# EAGLE design Son_Of_Dark_Power_Rev3 (EAGLE 7.2.0)

## Sheet 1 of 8
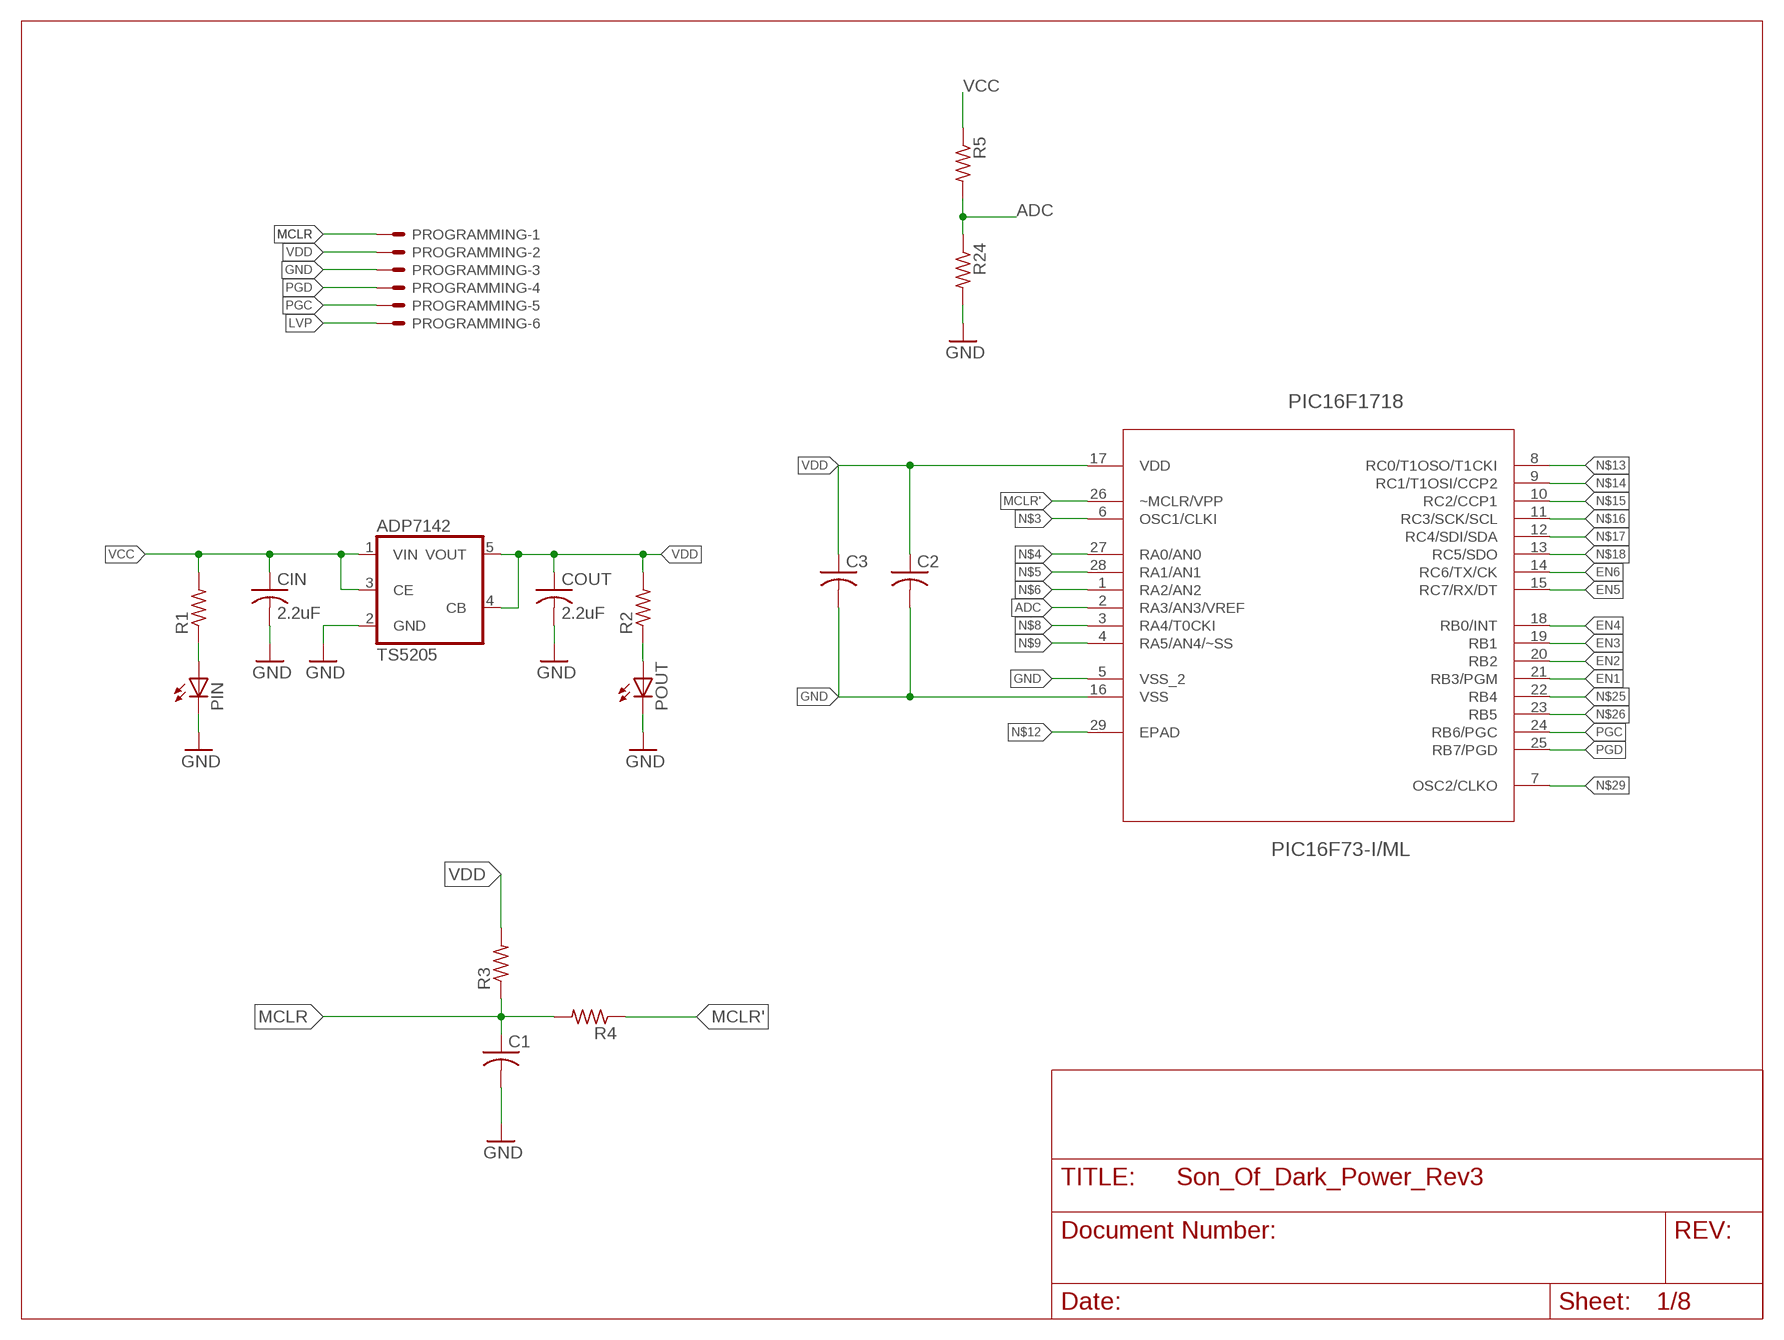
[diagram p0: schematic, sheet 1]

### Parts
ADP7142  TS5205  [SOT25]
C1  C-USC0805  [C0805]
C2  C-USC0805  [C0805]
C3  C-USC0805  [C0805]
CIN  2.2uF  C-USC1206K  [C1206K]
COUT  2.2uF  C-USC1206K  [C1206K]
PIC16F1718  PIC16F73-I/ML  [QFN65P600X600X100-28N]
PIN  LEDCHIPLED_1206  [CHIPLED_1206]
POUT  LEDCHIPLED_1206  [CHIPLED_1206]
PROGRAMMING  22-23-2061  [22-23-2061]
R1  R-US_R0805  [R0805]
R2  R-US_R0805  [R0805]
R3  R-US_R0805  [R0805]
R4  R-US_R0805  [R0805]
R5  R-US_R0805  [R0805]
R24  R-US_R0805  [R0805]

### Nets
ADC: PIC16F1718.2(RA3/AN3/VREF) R5.2 R24.1
EN1: PIC16F1718.21(RB3/PGM) ; also sheet 3
EN2: PIC16F1718.20(RB2) ; also sheet 4
EN3: PIC16F1718.19(RB1) ; also sheet 2
EN4: PIC16F1718.18(RB0/INT) ; also sheet 6
EN5: PIC16F1718.15(RC7/RX/DT) ; also sheet 7
EN6: PIC16F1718.14(RC6/TX/CK) ; also sheet 5
GND: ADP7142.2(GND) C1.2 C2.2 C3.2 CIN.2 COUT.2 PIC16F1718.5(VSS_2) PIC16F1718.16(VSS) PIN.C POUT.C PROGRAMMING.3 R24.2 ; also sheet 2,3,4,5,6,7,8
LVP: PROGRAMMING.6
MCLR: C1.1 PROGRAMMING.1 R3.1 R4.2
MCLR': PIC16F1718.26(~MCLR/VPP) R4.1
N$3: PIC16F1718.6(OSC1/CLKI)
N$4: PIC16F1718.27(RA0/AN0)
N$5: PIC16F1718.28(RA1/AN1)
N$6: PIC16F1718.1(RA2/AN2)
N$8: PIC16F1718.3(RA4/T0CKI)
N$9: PIC16F1718.4(RA5/AN4/~SS)
N$10: PIN.A R1.1
N$11: POUT.A R2.1
N$12: PIC16F1718.29(EPAD)
N$13: PIC16F1718.8(RC0/T1OSO/T1CKI)
N$14: PIC16F1718.9(RC1/T1OSI/CCP2)
N$15: PIC16F1718.10(RC2/CCP1)
N$16: PIC16F1718.11(RC3/SCK/SCL)
N$17: PIC16F1718.12(RC4/SDI/SDA)
N$18: PIC16F1718.13(RC5/SDO)
N$25: PIC16F1718.22(RB4)
N$26: PIC16F1718.23(RB5)
N$29: PIC16F1718.7(OSC2/CLKO)
PGC: PIC16F1718.24(RB6/PGC) PROGRAMMING.5
PGD: PIC16F1718.25(RB7/PGD) PROGRAMMING.4
VCC: ADP7142.1(VIN) ADP7142.3(CE) CIN.1 R1.2 R5.1 ; also sheet 2,3,4,5,6,7,8
VDD: ADP7142.4(CB) ADP7142.5(VOUT) C2.1 C3.1 COUT.1 PIC16F1718.17(VDD) PROGRAMMING.2 R2.2 R3.2

## Sheet 2 of 8
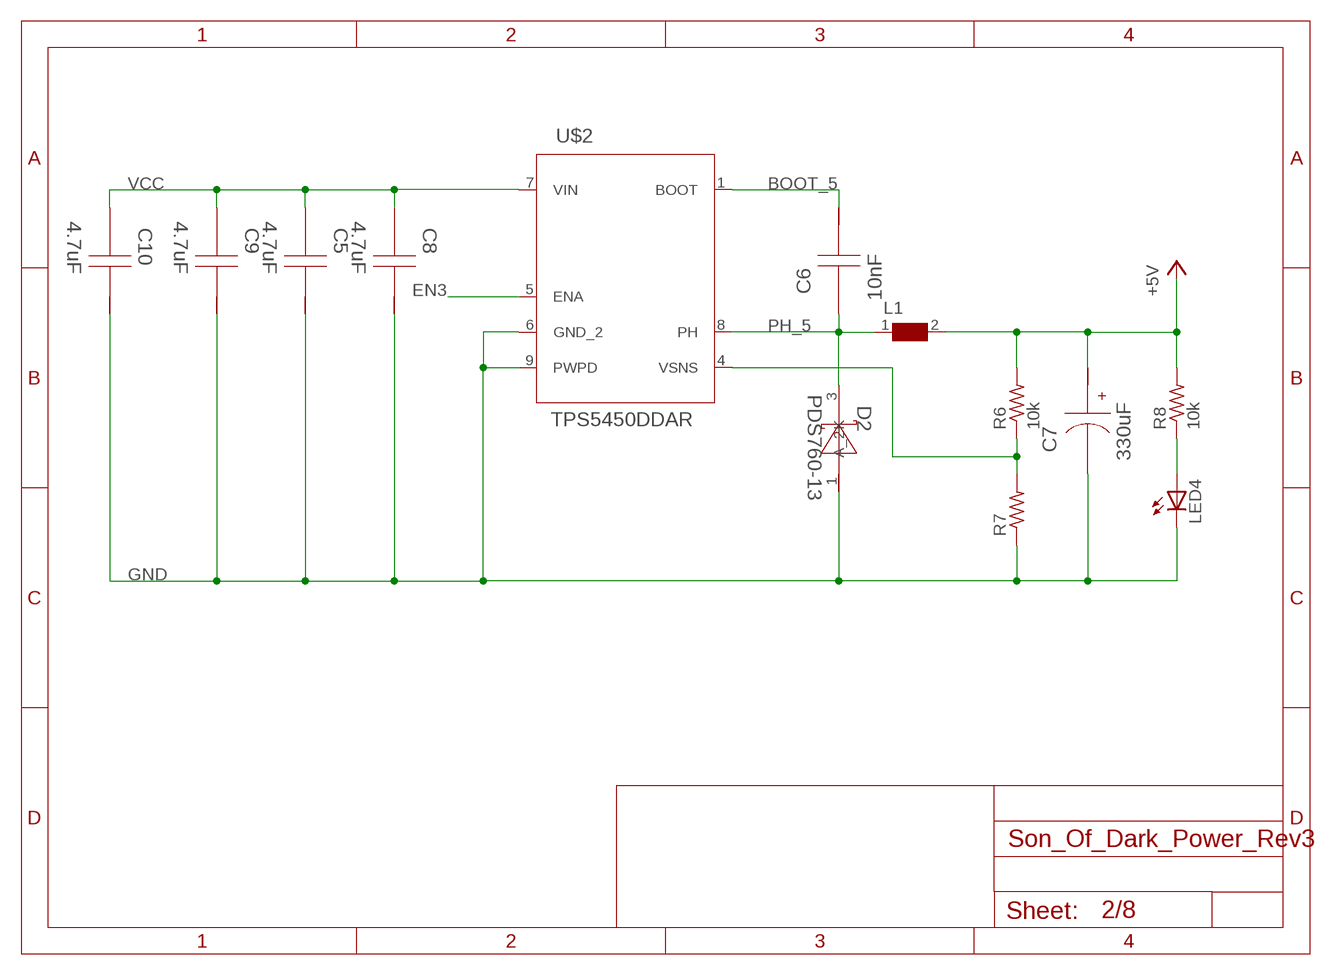
[diagram p1: schematic, sheet 2]

### Parts
C5  4.7uF  GRM31CR71H475KA12L  [1206]
C6  10nF  C0805C103K5RACTU  [0805]
C7  330uF  10SVP330MX  [SM_RADIAL_10AMM]
C8  4.7uF  GRM31CR71H475KA12L  [1206]
C9  4.7uF  GRM31CR71H475KA12L  [1206]
C10  4.7uF  GRM31CR71H475KA12L  [1206]
D2  PDS760-13  [POWERDI5]
L1  WE-HCC-7443331000_1090  [WE-HCC_1090]
LED4  LEDSML1206  [SML1206]
R6  10k  R-US_R1206  [R1206]
R7  R-US_R1206  [R1206]
R8  10k  R-US_R0805  [R0805]
U$2  TPS5450DDAR  [R-PDSO-G8]

### Nets
BOOT_5: C6.1 U$2.1(BOOT)
EN3: U$2.5(ENA) ; also sheet 1
GND: C5.1 C7.2(-) C8.1 C9.1 C10.1 D2.1(A_2) LED4.C R7.1 U$2.6(GND_2) U$2.9(PWPD) ; also sheet 1,3,4,5,6,7,8
N$28: LED4.A R8.1
PH_5: C6.2 D2.3(K) L1.1 U$2.8(PH)
VCC: C5.2 C8.2 C9.2 C10.2 U$2.7(VIN) ; also sheet 1,3,4,5,6,7,8
VOUT_3: C7.1(+) L1.2 R6.2 R8.2 ; supply symbol labelled +5V ; also sheet 8
VSNS_5: R6.1 R7.2 U$2.4(VSNS)

## Sheet 3 of 8
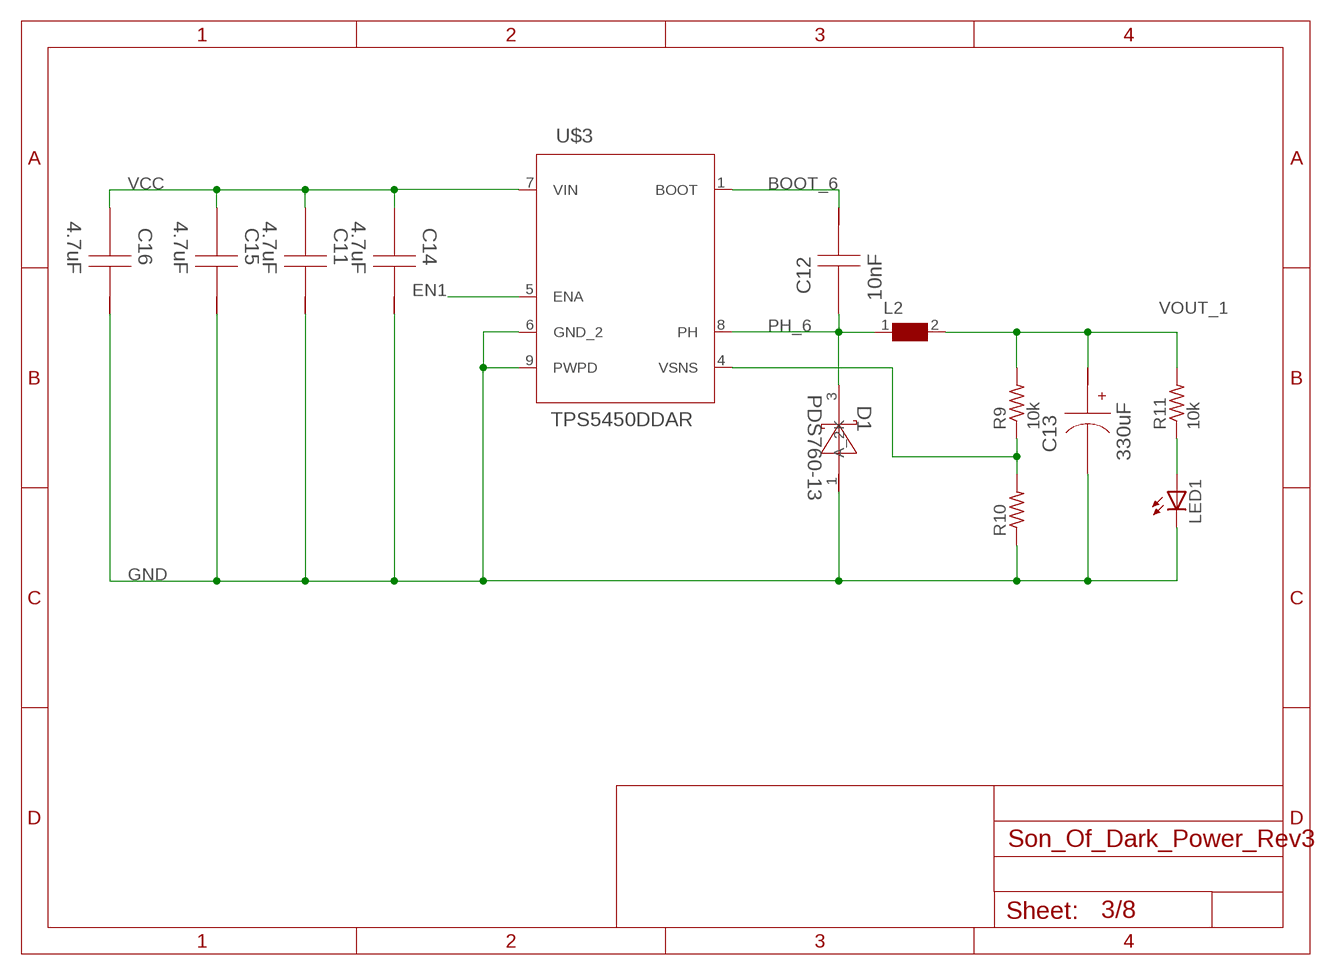
[diagram p2: schematic, sheet 3]

### Parts
C11  4.7uF  GRM31CR71H475KA12L  [1206]
C12  10nF  C0805C103K5RACTU  [0805]
C13  330uF  10SVP330MX  [SM_RADIAL_10AMM]
C14  4.7uF  GRM31CR71H475KA12L  [1206]
C15  4.7uF  GRM31CR71H475KA12L  [1206]
C16  4.7uF  GRM31CR71H475KA12L  [1206]
D1  PDS760-13  [POWERDI5]
L2  WE-HCC-7443331000_1090  [WE-HCC_1090]
LED1  LEDSML1206  [SML1206]
R9  10k  R-US_R1206  [R1206]
R10  R-US_R1206  [R1206]
R11  10k  R-US_R0805  [R0805]
U$3  TPS5450DDAR  [R-PDSO-G8]

### Nets
BOOT_6: C12.1 U$3.1(BOOT)
EN1: U$3.5(ENA) ; also sheet 1
GND: C11.1 C13.2(-) C14.1 C15.1 C16.1 D1.1(A_2) LED1.C R10.1 U$3.6(GND_2) U$3.9(PWPD) ; also sheet 1,2,4,5,6,7,8
N$30: LED1.A R11.1
PH_6: C12.2 D1.3(K) L2.1 U$3.8(PH)
VCC: C11.2 C14.2 C15.2 C16.2 U$3.7(VIN) ; also sheet 1,2,4,5,6,7,8
VOUT_1: C13.1(+) L2.2 R9.2 R11.2 ; also sheet 8
VSNS_6: R9.1 R10.2 U$3.4(VSNS)

## Sheet 4 of 8
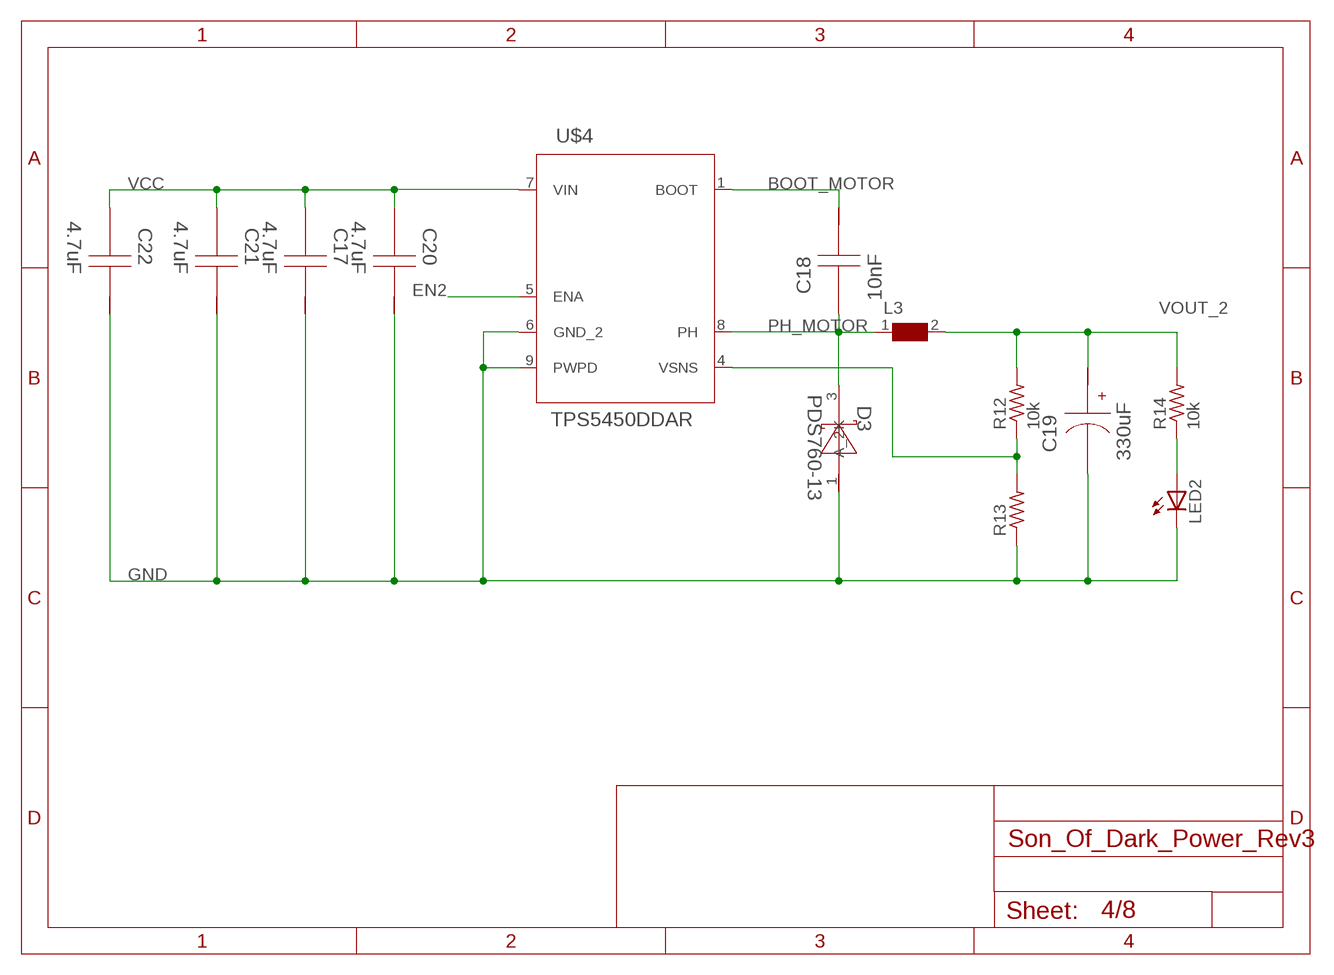
[diagram p3: schematic, sheet 4]

### Parts
C17  4.7uF  GRM31CR71H475KA12L  [1206]
C18  10nF  C0805C103K5RACTU  [0805]
C19  330uF  10SVP330MX  [SM_RADIAL_10AMM]
C20  4.7uF  GRM31CR71H475KA12L  [1206]
C21  4.7uF  GRM31CR71H475KA12L  [1206]
C22  4.7uF  GRM31CR71H475KA12L  [1206]
D3  PDS760-13  [POWERDI5]
L3  WE-HCC-7443331000_1090  [WE-HCC_1090]
LED2  LEDSML1206  [SML1206]
R12  10k  R-US_R1206  [R1206]
R13  R-US_R1206  [R1206]
R14  10k  R-US_R0805  [R0805]
U$4  TPS5450DDAR  [R-PDSO-G8]

### Nets
BOOT_MOTOR: C18.1 U$4.1(BOOT)
EN2: U$4.5(ENA) ; also sheet 1
GND: C17.1 C19.2(-) C20.1 C21.1 C22.1 D3.1(A_2) LED2.C R13.1 U$4.6(GND_2) U$4.9(PWPD) ; also sheet 1,2,3,5,6,7,8
N$31: LED2.A R14.1
PH_MOTOR: C18.2 D3.3(K) L3.1 U$4.8(PH)
VCC: C17.2 C20.2 C21.2 C22.2 U$4.7(VIN) ; also sheet 1,2,3,5,6,7,8
VOUT_2: C19.1(+) L3.2 R12.2 R14.2 ; also sheet 8
VSNS1_MOTOR: R12.1 R13.2 U$4.4(VSNS)

## Sheet 5 of 8
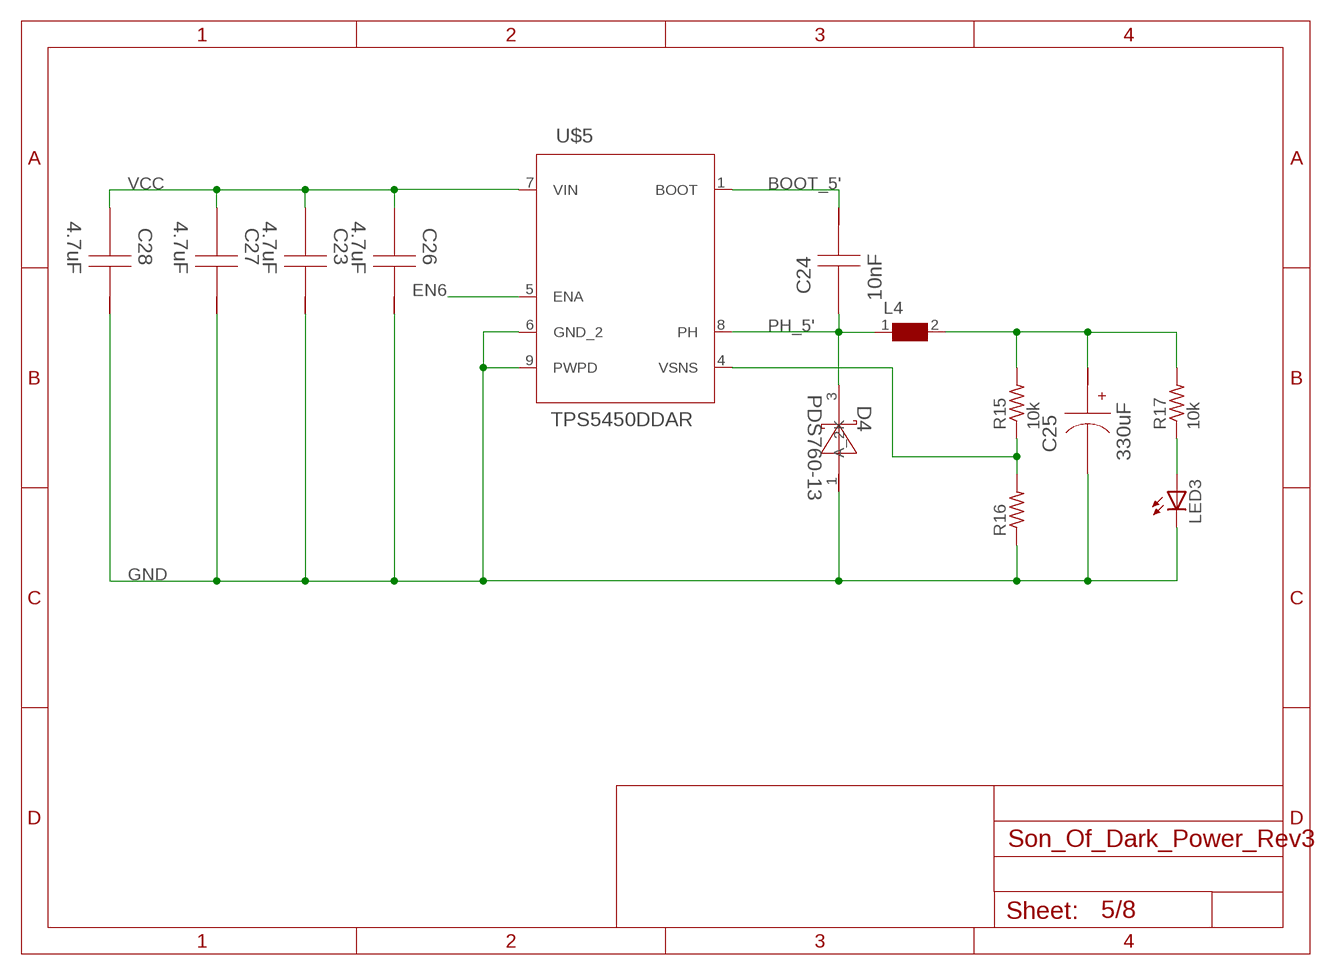
[diagram p4: schematic, sheet 5]

### Parts
C23  4.7uF  GRM31CR71H475KA12L  [1206]
C24  10nF  C0805C103K5RACTU  [0805]
C25  330uF  10SVP330MX  [SM_RADIAL_10AMM]
C26  4.7uF  GRM31CR71H475KA12L  [1206]
C27  4.7uF  GRM31CR71H475KA12L  [1206]
C28  4.7uF  GRM31CR71H475KA12L  [1206]
D4  PDS760-13  [POWERDI5]
L4  WE-HCC-7443331000_1090  [WE-HCC_1090]
LED3  LEDSML1206  [SML1206]
R15  10k  R-US_R1206  [R1206]
R16  R-US_R1206  [R1206]
R17  10k  R-US_R0805  [R0805]
U$5  TPS5450DDAR  [R-PDSO-G8]

### Nets
BOOT_5': C24.1 U$5.1(BOOT)
EN6: U$5.5(ENA) ; also sheet 1
GND: C23.1 C25.2(-) C26.1 C27.1 C28.1 D4.1(A_2) LED3.C R16.1 U$5.6(GND_2) U$5.9(PWPD) ; also sheet 1,2,3,4,6,7,8
N$32': LED3.A R17.1
PH_5': C24.2 D4.3(K) L4.1 U$5.8(PH)
VCC: C23.2 C26.2 C27.2 C28.2 U$5.7(VIN) ; also sheet 1,2,3,4,6,7,8
VOUT_6: C25.1(+) L4.2 R15.2 R17.2 ; also sheet 8
VSNS_1': R15.1 R16.2 U$5.4(VSNS)

## Sheet 6 of 8
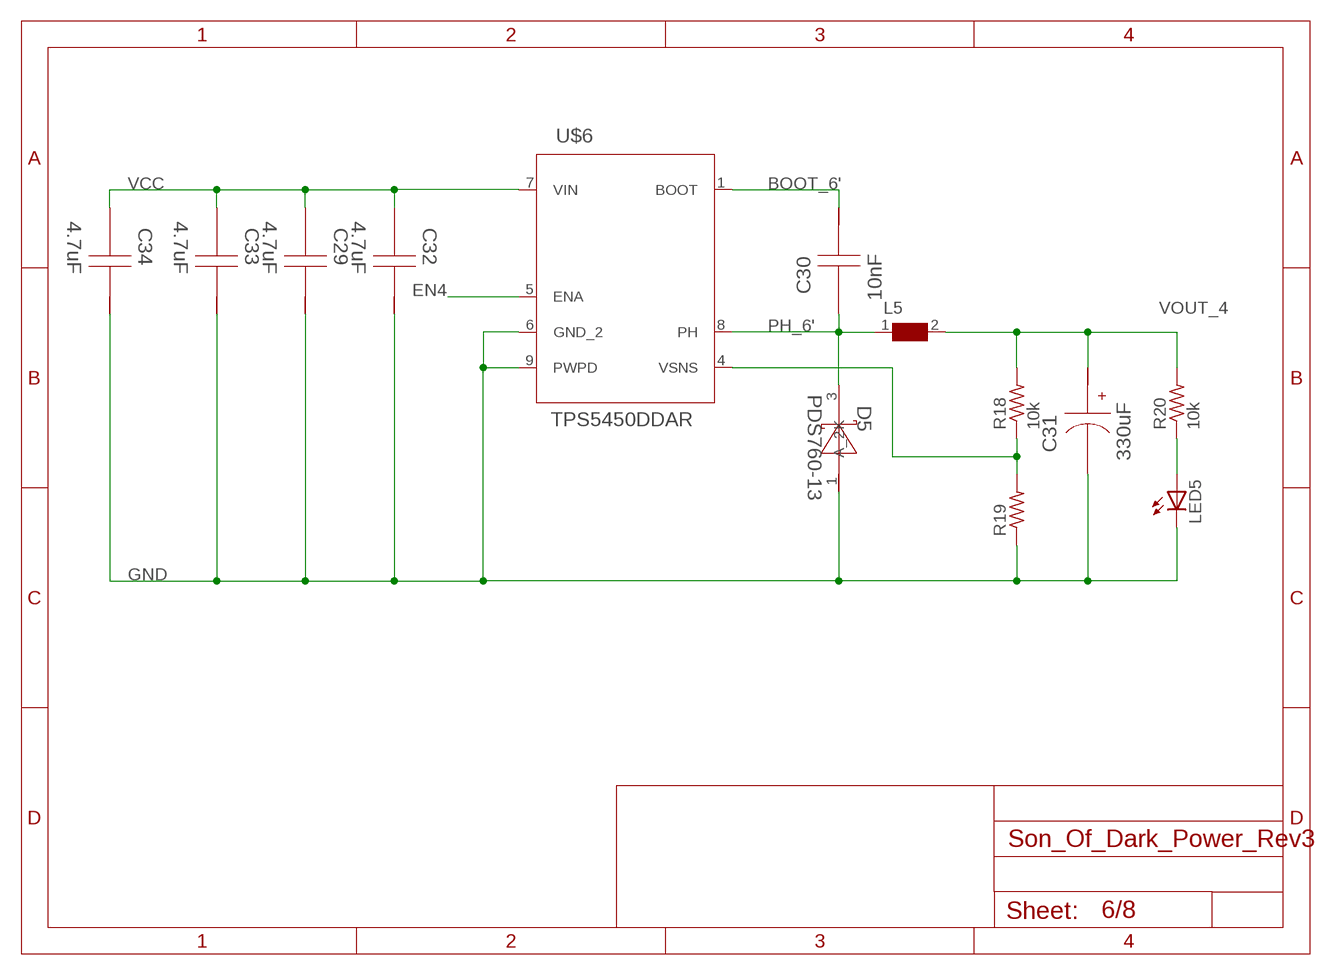
[diagram p5: schematic, sheet 6]

### Parts
C29  4.7uF  GRM31CR71H475KA12L  [1206]
C30  10nF  C0805C103K5RACTU  [0805]
C31  330uF  10SVP330MX  [SM_RADIAL_10AMM]
C32  4.7uF  GRM31CR71H475KA12L  [1206]
C33  4.7uF  GRM31CR71H475KA12L  [1206]
C34  4.7uF  GRM31CR71H475KA12L  [1206]
D5  PDS760-13  [POWERDI5]
L5  WE-HCC-7443331000_1090  [WE-HCC_1090]
LED5  LEDSML1206  [SML1206]
R18  10k  R-US_R1206  [R1206]
R19  R-US_R1206  [R1206]
R20  10k  R-US_R0805  [R0805]
U$6  TPS5450DDAR  [R-PDSO-G8]

### Nets
BOOT_6': C30.1 U$6.1(BOOT)
EN4: U$6.5(ENA) ; also sheet 1
GND: C29.1 C31.2(-) C32.1 C33.1 C34.1 D5.1(A_2) LED5.C R19.1 U$6.6(GND_2) U$6.9(PWPD) ; also sheet 1,2,3,4,5,7,8
N$33': LED5.A R20.1
PH_6': C30.2 D5.3(K) L5.1 U$6.8(PH)
VCC: C29.2 C32.2 C33.2 C34.2 U$6.7(VIN) ; also sheet 1,2,3,4,5,7,8
VOUT_4: C31.1(+) L5.2 R18.2 R20.2 ; also sheet 8
VSNS_2': R18.1 R19.2 U$6.4(VSNS)

## Sheet 7 of 8
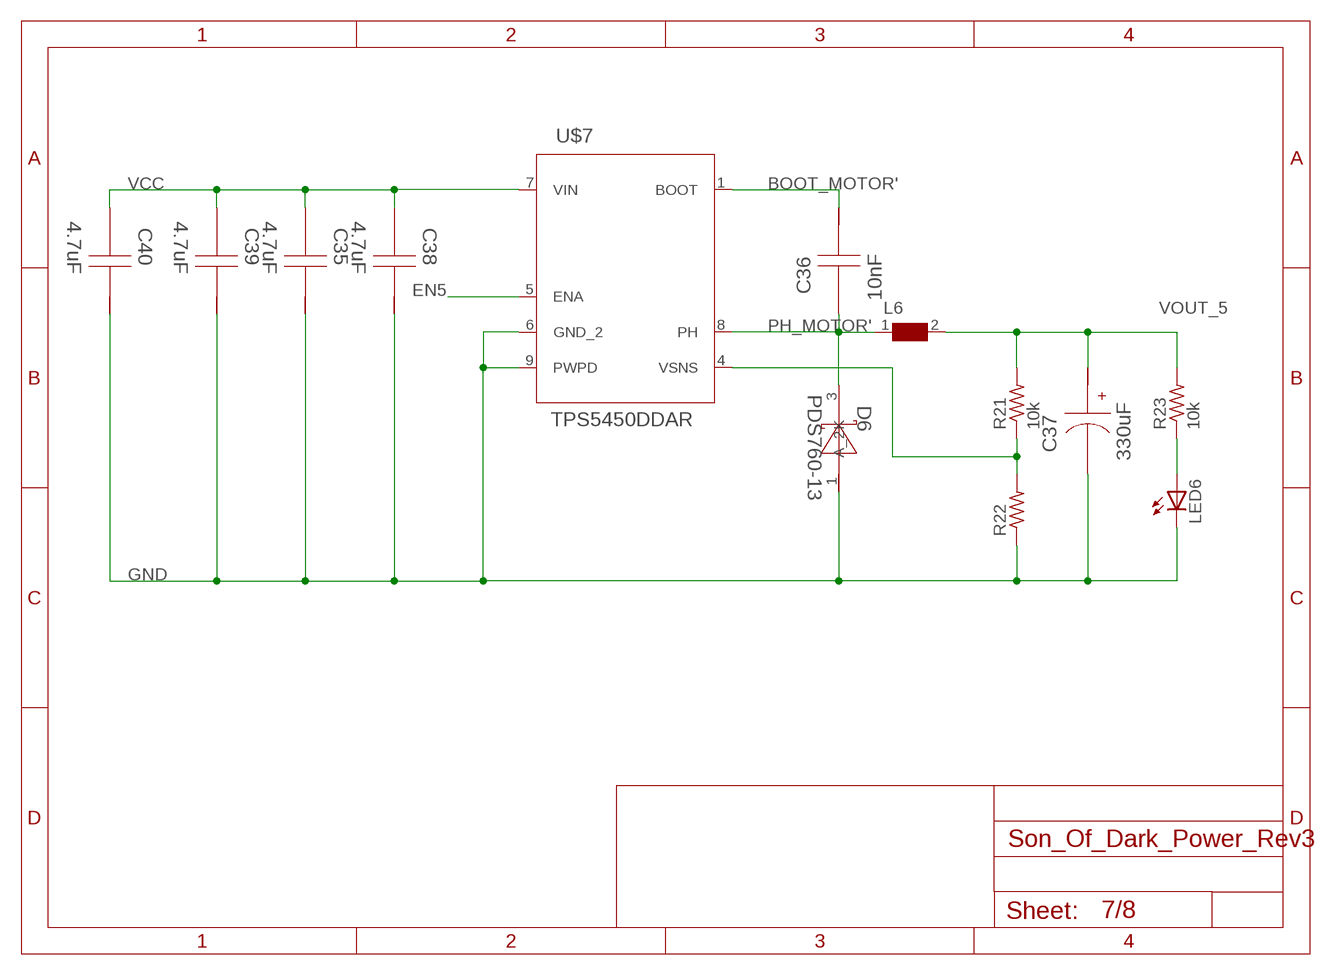
[diagram p6: schematic, sheet 7]

### Parts
C35  4.7uF  GRM31CR71H475KA12L  [1206]
C36  10nF  C0805C103K5RACTU  [0805]
C37  330uF  10SVP330MX  [SM_RADIAL_10AMM]
C38  4.7uF  GRM31CR71H475KA12L  [1206]
C39  4.7uF  GRM31CR71H475KA12L  [1206]
C40  4.7uF  GRM31CR71H475KA12L  [1206]
D6  PDS760-13  [POWERDI5]
L6  WE-HCC-7443331000_1090  [WE-HCC_1090]
LED6  LEDSML1206  [SML1206]
R21  10k  R-US_R1206  [R1206]
R22  R-US_R1206  [R1206]
R23  10k  R-US_R0805  [R0805]
U$7  TPS5450DDAR  [R-PDSO-G8]

### Nets
BOOT_MOTOR': C36.1 U$7.1(BOOT)
EN5: U$7.5(ENA) ; also sheet 1
GND: C35.1 C37.2(-) C38.1 C39.1 C40.1 D6.1(A_2) LED6.C R22.1 U$7.6(GND_2) U$7.9(PWPD) ; also sheet 1,2,3,4,5,6,8
N$34': LED6.A R23.1
PH_MOTOR': C36.2 D6.3(K) L6.1 U$7.8(PH)
VCC: C35.2 C38.2 C39.2 C40.2 U$7.7(VIN) ; also sheet 1,2,3,4,5,6,8
VOUT_5: C37.1(+) L6.2 R21.2 R23.2 ; also sheet 8
VSNS1_MOTOR1': R21.1 R22.2 U$7.4(VSNS)

## Sheet 8 of 8
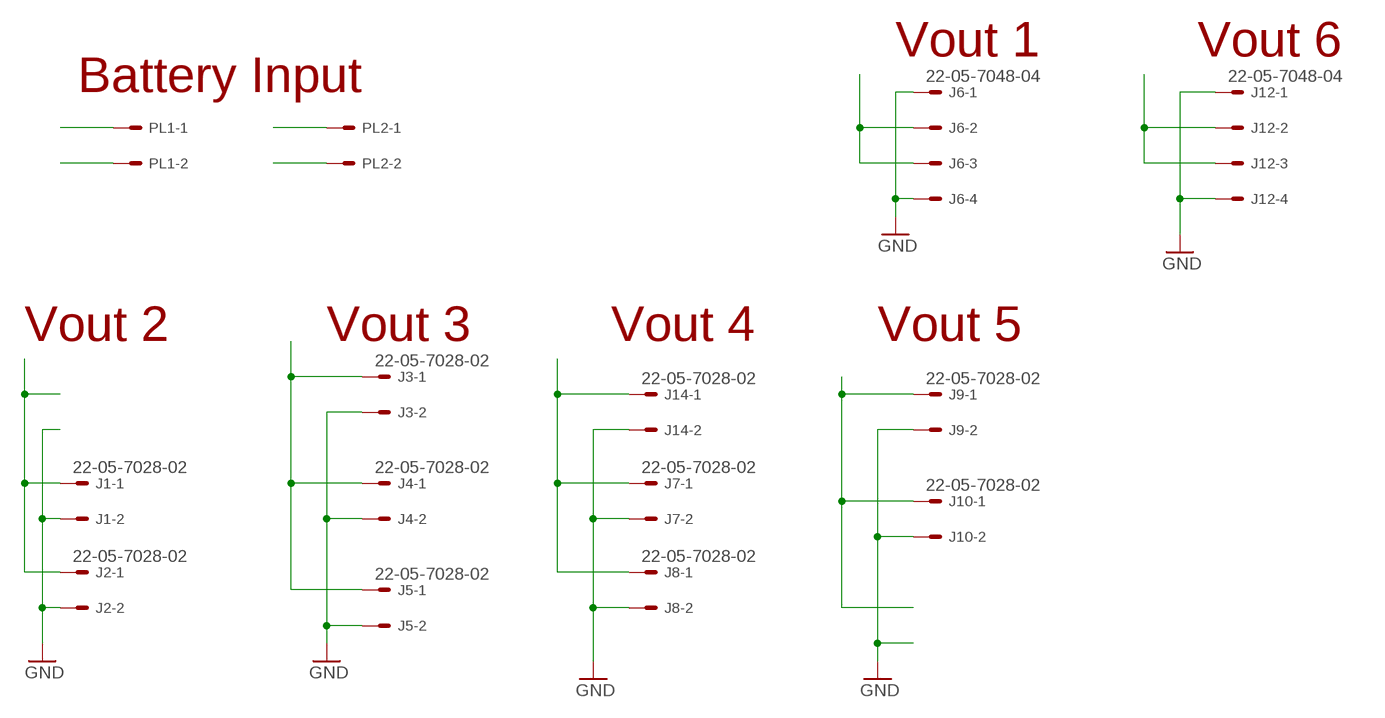
[diagram p7: schematic, sheet 8]

### Parts
J1  22-05-7028-02  [7395-02]
J2  22-05-7028-02  [7395-02]
J3  22-05-7028-02  [7395-02]
J4  22-05-7028-02  [7395-02]
J5  22-05-7028-02  [7395-02]
J6  22-05-7048-04  [7395-04]
J7  22-05-7028-02  [7395-02]
J8  22-05-7028-02  [7395-02]
J9  22-05-7028-02  [7395-02]
J10  22-05-7028-02  [7395-02]
J12  22-05-7048-04  [7395-04]
J14  22-05-7028-02  [7395-02]
PL1  555X-2H  [5569-2]
PL2  555X-2H  [5569-2]

### Nets
GND: J1.2 J2.2 J3.2 J4.2 J5.2 J6.1 J6.4 J7.2 J8.2 J9.2 J10.2 J12.1 J12.4 J14.2 PL1.1 PL2.1 ; also sheet 1,2,3,4,5,6,7
VCC: PL1.2 PL2.2 ; also sheet 1,2,3,4,5,6,7
VOUT_1: J6.2 J6.3 ; also sheet 3
VOUT_2: J1.1 J2.1 ; also sheet 4
VOUT_3: J3.1 J4.1 J5.1 ; also sheet 2
VOUT_4: J7.1 J8.1 J14.1 ; also sheet 6
VOUT_5: J9.1 J10.1 ; also sheet 7
VOUT_6: J12.2 J12.3 ; also sheet 5

### Notes on the sheet
- Vout 1 | Vout 6
- Battery Input
- Vout 2 | Vout 3 | Vout 4 | Vout 5

## Library data of the parts
ADP7142 = RPLidar_interface:TS5205: 150mA Low Noise LDO Voltage Regulator with Enable TSC [Taiwan Semiconductor Company, Ltd] Source: http://www.taiwansemi.com .. 5205_0409c.pdf
C1-C3 CIN COUT = rcl:C-US: CAPACITOR, American symbol
C5 C8-C11 C14-C17 C20-C23 C26-C29 C32-C35 C38-C40 = 5v:GRM31CR71H475KA12L; CAP: 4.7E-6; ESR: 0.0; IRMS: 0.0; MANUFACTURER_NAME: MuRata; MANUFACTURER_PART_NUMBER: GRM31CR71H475KA12L; VDC: 50.0; VENDOR: MuRata
C6 C12 C18 C24 C30 C36 = 5v:C0805C103K5RACTU; CAP: 1.0E-8; ESR: 1.739; IRMS: 0.411; MANUFACTURER_NAME: Kemet; MANUFACTURER_PART_NUMBER: C0805C103K5RACTU; VDC: 50.0; VENDOR: Kemet
C7 C13 C19 C25 C31 C37 = 5v:10SVP330MX; CAP: 3.3E-4; DATASHEETURL: http://www.edc.sanyo.com/english/pdf/oscon/E32.pdf; ESR: 0.025; IRMS: 3.7; MANUFACTURER_NAME: Panasonic; MANUFACTURER_PART_NUMBER: 10SVP330MX; VDC: 10.0; VENDOR: Panasonic
D1-D6 = 5v:PDS760-13; DATASHEETURL: www.diodes.com/datasheets/ds30477.pdf; IO: 7.0; MANUFACTURER_NAME: Diodes Inc.; MANUFACTURER_PART_NUMBER: PDS760-13; VENDOR: Diodes Inc.; VFATIO: 0.56; VRRM: 60.0
J1-J5 J7-J10 J14 = Son_of_Dark_Powersch:22-?-02: CONNECTOR wire to board 2.54 mm (.1 inch) pitch header; OC_FARNELL: 9731601; OC_NEWARK: unknown
J6 J12 = Son_of_Dark_Powersch:22-?-04: CONNECTOR wire to board 2.54 mm (.1 inch) pitch header; OC_FARNELL: unknown; OC_NEWARK: unknown
L1-L6 = WE-HCC:WE-HCC: SMD High Current Cube Inductor WE-HCC - magnetically shieled - current capability up to 27A - excellent saturation characteristics -- filter choke for DC/DC converter -- single and polyphase buck converter -- filter choke for motor electronics; MPN: 7443331000; OC_FARNELL: 1848254; OC_NEWARK: 13T9771; PACKAGE: 1090; SUPPLIER: Wuerth Elektronik
LED1-LED6 = led:LED: LED OSRAM: - CHIPLED LG R971, LG N971, LY N971, LG Q971, LY Q971, LO R971, LY R971 LH N974, LH R974 LS Q976, LO Q976, LY Q976 LO Q996 - Hyper CHIPLED LW Q18S LB Q993, LB Q99A, LB R99A - SideLED LS A670, LO A670, LY A670, LG A670, LP A670 LB A673, LV A673, LT A673, LW A673 LH A674 LY A675 LS A676, LA A676, LO A676, LY A676, LW A676 LS A679, LY A679, LG A679 - Hyper Micro SIDELED® LS Y876, LA Y876, LO Y876, LY Y876 LT Y87S - SmartLED LW L88C, LW L88S LB L89C, LB L89S, LG L890 LS L89K, LO L89K, LY L89K LS L896, LA L896, LO L896, LY L896 - TOPLED LS T670, LO T670, LY T670, LG T670, LP T670 LSG T670, LSP T670, LSY T670, LOP T670, LYG T670 LG T671, LOG T671, LSG T671 LB T673, LV T673, LT T673, LW T673 LH T674 LS T676, LA T676, LO T676, LY T676, LB T676, LH T676, LSB T676, LW T676 LB T67C, LV T67C, LT T67C, LS T67K, LO T67K, LY T67K, LW E67C LS E67B, LA E67B, LO E67B, LY E67B, LB E67C, LV E67C, LT E67C LW T67C LS T679, LY T679, LG T679 LS T770, LO T770, LY T770, LG T770, LP T770 LB T773, LV T773, LT T773, LW T773 LH T774 LS E675, LA E675, LY E675, LS T675 LS T776, LA T776, LO T776, LY T776, LB T776 LHGB T686 LT T68C, LB T68C - Hyper Mini TOPLED® LB M676 - Mini TOPLED Santana® LG M470 LS M47K, LO M47K, LY M47K Source: http://www.osram.convergy.de LUXEON: - LUMILED® LXK2-PW12-R00, LXK2-PW12-S00, LXK2-PW14-U00, LXK2-PW14-V00 LXK2-PM12-R00, LXK2-PM12-S00, LXK2-PM14-U00 LXK2-PE12-Q00, LXK2-PE12-R00, LXK2-PE12-S00, LXK2-PE14-T00, LXK2-PE14-U00 LXK2-PB12-K00, LXK2-PB12-L00, LXK2-PB12-M00, LXK2-PB14-N00, LXK2-PB14-P00, LXK2-PB14-Q00 LXK2-PR12-L00, LXK2-PR12-M00, LXK2-PR14-Q00, LXK2-PR14-R00 LXK2-PD12-Q00, LXK2-PD12-R00, LXK2-PD12-S00 LXK2-PH12-R00, LXK2-PH12-S00 LXK2-PL12-P00, LXK2-PL12-Q00, LXK2-PL12-R00 Source: www.luxeon.com KINGBRIGHT: KA-3528ASYC Source: www.kingbright.com
PIC16F1718 = RPLidar_interface:PIC16F73-I/ML: 8-bit CMOS FLASH Microcontrollers; DESCRIPTION: 8-bit CMOS FLASH Microcontrollers; MPN: PIC16F73-I/ML; OC_FARNELL: 1084327; OC_NEWARK: 97K7368; PACKAGE: QFN-28; SUPPLIER: Microchip
PIN POUT = Son_of_Dark_Powersch:LED: LED OSRAM: - CHIPLED LG R971, LG N971, LY N971, LG Q971, LY Q971, LO R971, LY R971 LH N974, LH R974 LS Q976, LO Q976, LY Q976 LO Q996 - Hyper CHIPLED LW Q18S LB Q993, LB Q99A, LB R99A - SideLED LS A670, LO A670, LY A670, LG A670, LP A670 LB A673, LV A673, LT A673, LW A673 LH A674 LY A675 LS A676, LA A676, LO A676, LY A676, LW A676 LS A679, LY A679, LG A679 - Hyper Micro SIDELED® LS Y876, LA Y876, LO Y876, LY Y876 LT Y87S - SmartLED LW L88C, LW L88S LB L89C, LB L89S, LG L890 LS L89K, LO L89K, LY L89K LS L896, LA L896, LO L896, LY L896 - TOPLED LS T670, LO T670, LY T670, LG T670, LP T670 LSG T670, LSP T670, LSY T670, LOP T670, LYG T670 LG T671, LOG T671, LSG T671 LB T673, LV T673, LT T673, LW T673 LH T674 LS T676, LA T676, LO T676, LY T676, LB T676, LH T676, LSB T676, LW T676 LB T67C, LV T67C, LT T67C, LS T67K, LO T67K, LY T67K, LW E67C LS E67B, LA E67B, LO E67B, LY E67B, LB E67C, LV E67C, LT E67C LW T67C LS T679, LY T679, LG T679 LS T770, LO T770, LY T770, LG T770, LP T770 LB T773, LV T773, LT T773, LW T773 LH T774 LS E675, LA E675, LY E675, LS T675 LS T776, LA T776, LO T776, LY T776, LB T776 LHGB T686 LT T68C, LB T68C - Hyper Mini TOPLED® LB M676 - Mini TOPLED Santana® LG M470 LS M47K, LO M47K, LY M47K Source: http://www.osram.convergy.de LUXEON: - LUMILED® LXK2-PW12-R00, LXK2-PW12-S00, LXK2-PW14-U00, LXK2-PW14-V00 LXK2-PM12-R00, LXK2-PM12-S00, LXK2-PM14-U00 LXK2-PE12-Q00, LXK2-PE12-R00, LXK2-PE12-S00, LXK2-PE14-T00, LXK2-PE14-U00 LXK2-PB12-K00, LXK2-PB12-L00, LXK2-PB12-M00, LXK2-PB14-N00, LXK2-PB14-P00, LXK2-PB14-Q00 LXK2-PR12-L00, LXK2-PR12-M00, LXK2-PR14-Q00, LXK2-PR14-R00 LXK2-PD12-Q00, LXK2-PD12-R00, LXK2-PD12-S00 LXK2-PH12-R00, LXK2-PH12-S00 LXK2-PL12-P00, LXK2-PL12-Q00, LXK2-PL12-R00 Source: www.luxeon.com KINGBRIGHT: KA-3528ASYC Source: www.kingbright.com
PL1 PL2 = Son_of_Dark_Powersch:555X-2: Mini FIT connector 2 way
PROGRAMMING = con-molex:22-23-2061: .100" (2.54mm) Center Header - 6 Pin; MF: MOLEX; MPN: 22-23-2061; OC_FARNELL: 1462922; OC_NEWARK: 27C1933
R1-R24 = rcl:R-US_: RESISTOR, American symbol
U$2-U$7 = 5v:TPS5450DDAR; DATASHEETURL: http://www.ti.com/product/tps5450; FREQUENCY: 500000.0; IMAX: 5.0; MANUFACTURER_NAME: Texas Instruments; MANUFACTURER_PART_NUMBER: TPS5450DDA; MKTG_PACKAGE: TPS5450; NSID: TPS5450DDAR; PACKAGE: TPS5450; VENDOR: Texas Instruments

## Board
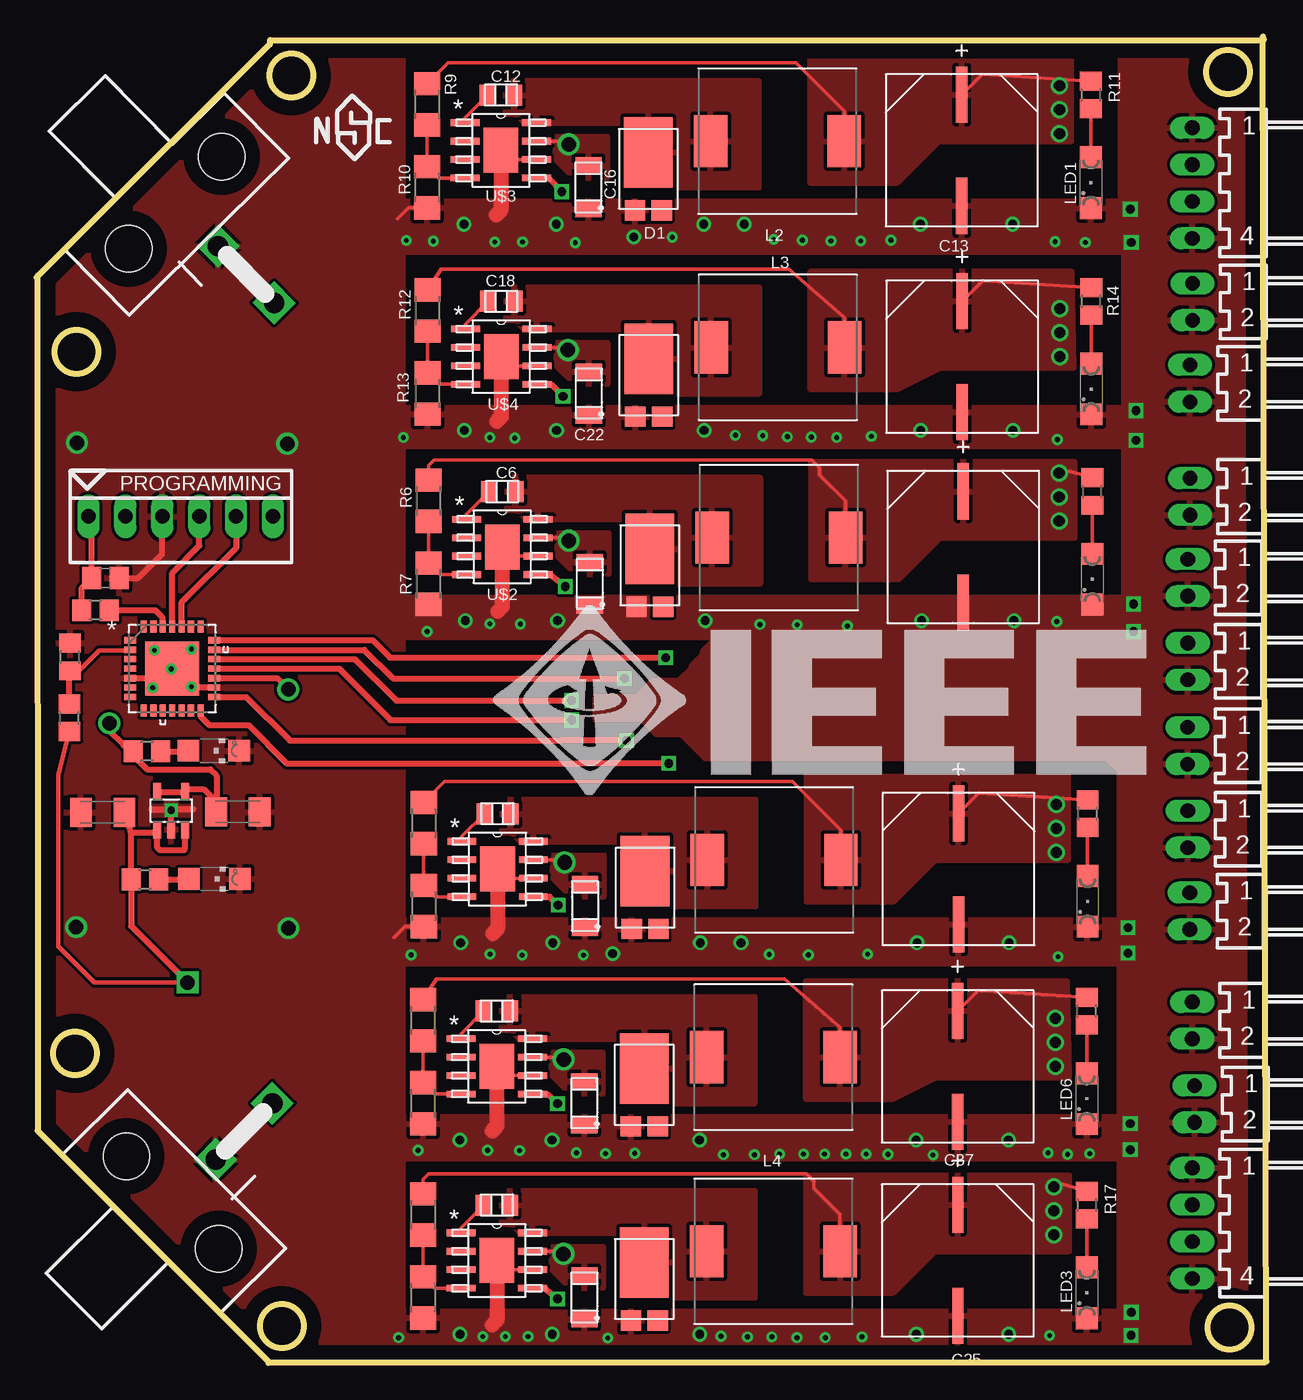
[diagram p8: board, top side]
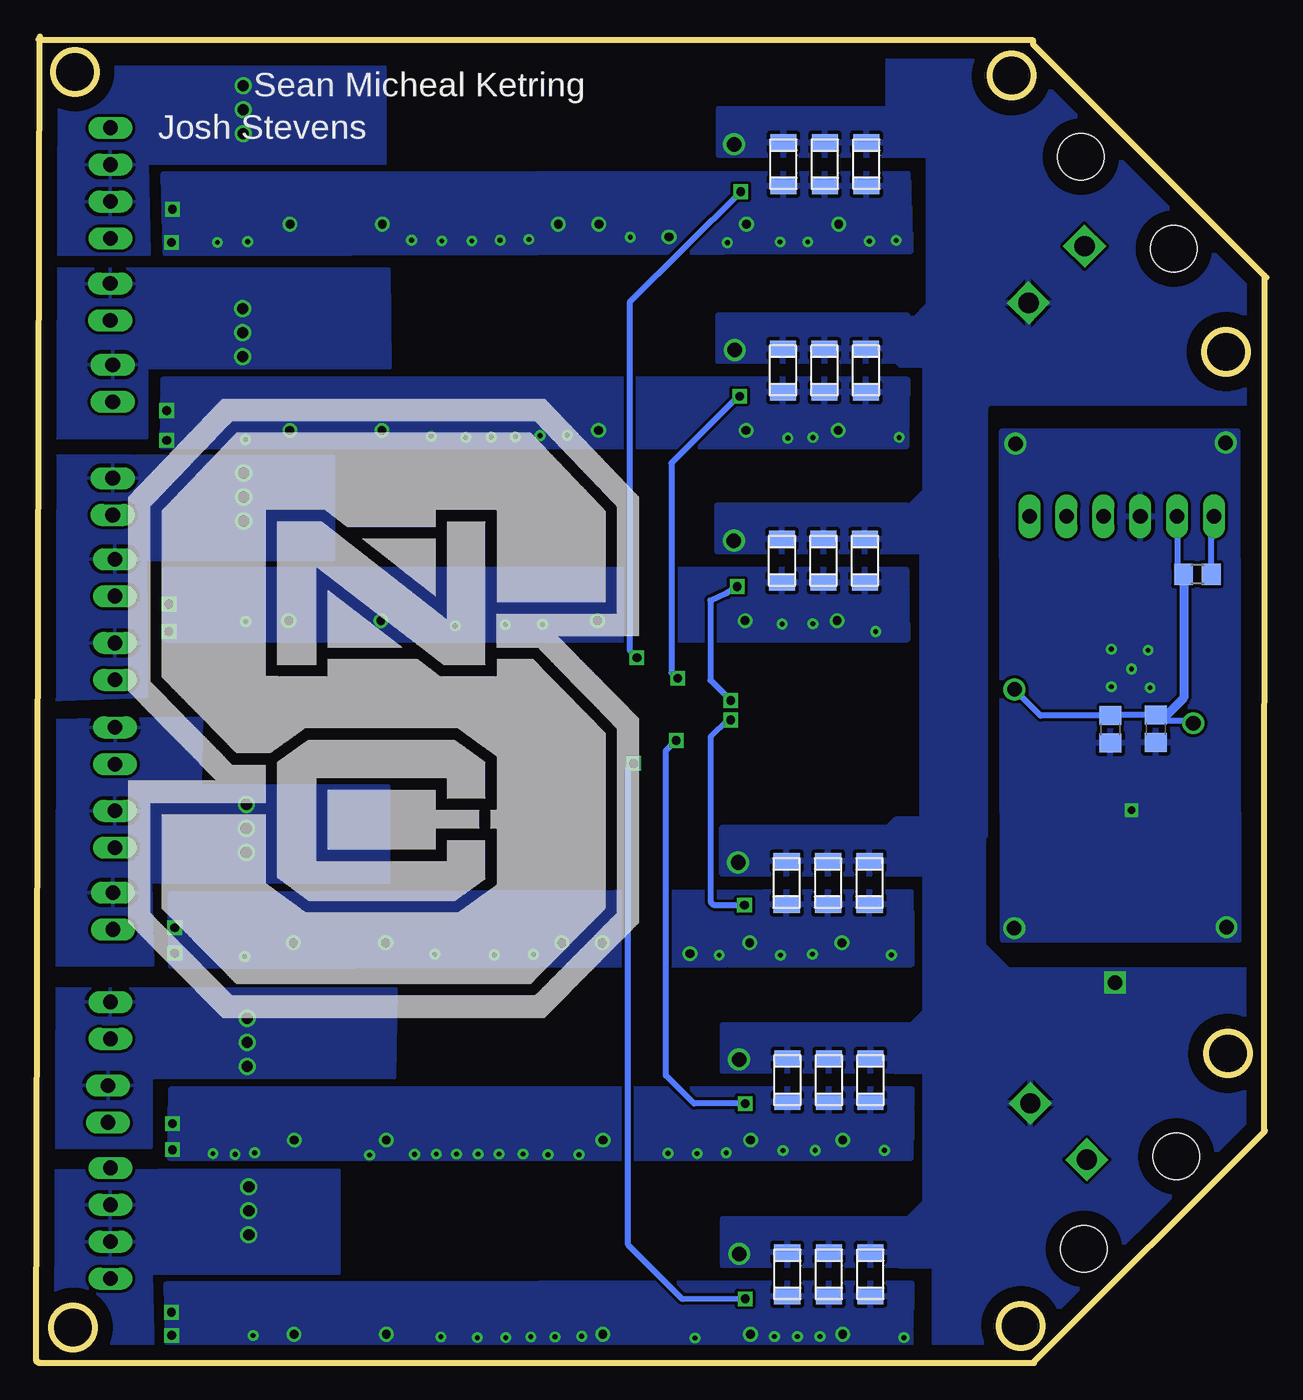
[diagram p9: board, bottom side, seen from below]

Size 84.72 x 91.39 mm. Coordinates in mm from the lower left corner, seen from the top.
Outline: 84.72,0.13 84.48,91.39
Outline: 0.09,16.02 15.98,0.12
Outline: 16.08,91.11 16.08,90.84 0,74.78
Outline: 16.12,91.12 84.51,91.12 84.57,91.18
Outline: 84.57,0.08 84.61,0.04 16.02,0.04 15.98,0
Outline: 0.14,15.98 0.11,74.91
Outline: circle at 82.07,88.94 radius 1.5
Outline: circle at 82.18,2.46 radius 1.5
Outline: circle at 2.76,69.67 radius 1.5
Outline: circle at 2.65,21.34 radius 1.5
Outline: circle at 17.56,88.68 radius 1.5
Outline: circle at 16.91,2.57 radius 1.5
Copper layers (1*16): Top 0.035mm / dielectric 1.5mm / Bottom 0.035mm
Design rules "default": minimum track width 10mil, minimum drill 24mil, track to track 8mil, track to pad 8mil, pad to pad 8mil, via to via 8mil, smd to smd 8mil, copper to edge 40mil, drill to drill 8mil, minimum pad ring 10mil, minimum via ring 8mil, stop-mask expansion 4mil, vias tented up to drill 0mil, thermal gap 10mil

### Footprints (pad centres in the part's own frame; a part is rotated, then mirrored left to right if it is on the bottom)
SOT25 = smd 0.55 x 1.2: 1 -0.95,-1.3; 2 0,-1.3; 3 0.95,-1.3; 4 0.95,1.3; 5 -0.95,1.3
C0805 = smd 1.3 x 1.5: 1 -0.95,0; 2 0.95,0
1206 = smd 1.118 x 1.803: 1 -1.499,0; 2 1.499,0
0805 = smd 1.118 x 1.448: 1 -0.902,0; 2 0.902,0
SM_RADIAL_10AMM = smd 3.861 x 0.787: 1 -3.823,0; 2 3.823,0
C1206K = smd 1.5 x 2: 1 -1.5,0; 2 1.5,0
POWERDI5 = smd 1.397 x 1.397: 1 -0.92,-2.857; 2 0.92,-2.857 | smd 3.353 x 4.851: 3 0,1.13
7395-02 = drill 1.016 long: 1 1.27,0; 2 -1.27,0
7395-04 = drill 1.016 long: 1 3.81,0; 2 1.27,0; 3 -1.27,0; 4 -3.81,0
WE-HCC_1090 = smd 2.3 x 3.6: 1 -4.6,0; 2 4.6,0
SML1206 = smd 1.5 x 1.5: A 1.75,0; C -1.75,0
QFN65P600X600X100-28N = smd 0.813 x 0.432: 1 -2.896,1.956; 2 -2.896,1.295; 3 -2.896,0.66; 4 -2.896,0; 5 -2.896,-0.66; 6 -2.896,-1.295; 7 -2.896,-1.956; 15 2.896,-1.956; 16 2.896,-1.295; 17 2.896,-0.66; 18 2.896,0; 19 2.896,0.66; 20 2.896,1.295; 21 2.896,1.956 | smd 0.432 x 0.813: 8 -1.956,-2.896; 9 -1.295,-2.896; 10 -0.66,-2.896; 11 0,-2.896; 12 0.66,-2.896; 13 1.295,-2.896; 14 1.956,-2.896; 22 1.956,2.896; 23 1.295,2.896; 24 0.66,2.896; 25 0,2.896; 26 -0.66,2.896; 27 -1.295,2.896; 28 -1.956,2.896 | smd 3.708 x 3.708: 29 0,0
CHIPLED_1206 = smd 1.5 x 1.5: A 0,-1.75; C 0,1.75
5569-2 = drill 1.4 square: 1 0,0; 2 0,5.5 | hole 3.2: 4.5,-4.2; -4.5,-4.2
22-23-2061 = drill 1 long: 1 -6.35,0; 2 -3.81,0; 3 -1.27,0; 4 1.27,0; 5 3.81,0; 6 6.35,0
R0805 = smd 1.3 x 1.5: 1 -0.95,0; 2 0.95,0
R1206 = smd 1.6 x 1.803: 1 -1.422,0; 2 1.422,0
R-PDSO-G8 = smd 1.981 x 0.457: 1 -2.464,1.905; 2 -2.464,0.635; 3 -2.464,-0.635; 4 -2.464,-1.905; 5 2.464,-1.905; 6 2.464,-0.635; 7 2.464,0.635; 8 2.464,1.905 | smd 2.388 x 3.099: 9 0,0

### Placement (x,y rotation side)
ADP7142  9.29,38.05 0 top
C1  4.76,54.08 0 top
C2  7.62,43.69 270 bottom
C3  10.74,43.66 270 bottom
C5  33.36,55.27 90 bottom
C6  32.09,60.04 0 top
C7  63.84,56.23 270 top
C8  30.51,55.27 90 bottom
C9  27.65,55.27 90 bottom
C10  38.13,53.69 90 top
C11  33.27,82.58 90 bottom
C12  32,87.34 0 top
C13  63.75,83.53 270 top
C14  30.41,82.58 90 bottom
C15  27.55,82.58 90 bottom
C16  38.03,80.99 90 top
C17  33.29,68.37 90 bottom
C18  32.02,73.13 0 top
C19  63.77,69.32 270 top
C20  30.44,68.37 90 bottom
C21  27.58,68.37 90 bottom
C22  38.06,66.78 90 top
C23  32.99,6.12 90 bottom
C24  31.72,10.89 0 top
C25  63.47,7.08 270 top
C26  30.14,6.12 90 bottom
C27  27.28,6.12 90 bottom
C28  37.76,4.54 90 top
C29  33.04,33.08 90 bottom
C30  31.77,37.84 0 top
C31  63.52,34.03 270 top
C32  30.18,33.08 90 bottom
C33  27.32,33.08 90 bottom
C34  37.8,31.49 90 top
C35  32.98,19.49 90 bottom
C36  31.71,24.25 0 top
C37  63.46,20.44 270 top
C38  30.13,19.49 90 bottom
C39  27.27,19.49 90 bottom
C40  37.75,17.9 90 top
CIN  4.57,37.94 180 top
COUT  13.89,37.98 0 top
D1  42.16,82.26 0 top
D2  42.25,54.96 0 top
D3  42.18,68.05 0 top
D4  41.88,5.81 0 top
D5  41.93,32.76 0 top
D6  41.87,19.17 0 top
J1  79.63,73.1 90 top
J2  79.46,67.49 90 top
J3  79.46,59.69 90 top
J4  79.31,54.1 90 top
J5  79.31,48.34 90 top
J6  79.62,81.28 90 top
J7  79.3,42.53 90 top
J8  79.31,36.78 90 top
J9  79.62,23.61 90 top
J10  79.78,17.85 90 top
J12  79.62,9.64 90 top
J14  79.44,31.14 90 top
L1  51.14,56.86 0 top
L2  51.05,84.17 0 top
L3  51.07,69.96 0 top
L4  50.77,7.71 0 top
L5  50.82,34.67 0 top
L6  50.76,21.08 0 top
LED1  72.64,81.31 90 top
LED2  72.66,67.1 90 top
LED3  72.36,4.85 90 top
LED4  72.73,54 90 top
LED5  72.41,31.81 90 top
LED6  72.35,18.22 90 top
PIC16F1718  9.36,47.84 0 top
PIN  12.27,33.35 270 top
PL1  12.52,76.94 224.6 top
PL2  12.36,14.02 314.9 top
POUT  12.22,42.18 270 top
PROGRAMMING  9.95,58.32 0 top
R1  7.48,33.31 180 top
R2  7.62,42.14 180 top
R3  4.75,54.33 180 bottom
R4  4.08,51.86 180 top
R5  2.28,44.46 90 top
R6  27.01,59.4 90 top
R7  27.01,53.69 90 top
R8  72.73,60.04 90 top
R9  26.92,86.71 90 top
R10  26.92,80.99 90 top
R11  72.64,87.34 90 top
R12  26.94,72.5 90 top
R13  26.94,66.78 90 top
R14  72.66,73.13 90 top
R15  26.64,10.25 90 top
R16  26.64,4.54 90 top
R17  72.36,10.89 90 top
R18  26.69,37.21 90 top
R19  26.69,31.49 90 top
R20  72.41,37.84 90 top
R21  26.63,23.62 90 top
R22  26.63,17.9 90 top
R23  72.35,24.25 90 top
R24  2.32,48.64 90 top
U$2  32.09,56.23 0 top
U$3  32,83.53 0 top
U$4  32.02,69.32 0 top
U$5  31.72,7.08 0 top
U$6  31.77,34.03 0 top
U$7  31.71,20.44 0 top

### Tracks (layer width: path | path; a pad name or v marks a point on that pad's centre or on a via)
ADC
  Top 0.305: PIC16F1718.2 6.43,49.1 4.32,49.1 2.91,47.69 R24.1
  Top 0.406: R5.2 2.28,47.65 R24.1
BOOT_5
  Top 0.254: U$2.1 29.63,58.47 C6.1
BOOT_5'
  Top 0.254: U$5.1 29.26,9.32 C24.1
BOOT_6
  Top 0.254: U$3.1 29.53,85.78 C12.1
BOOT_6'
  Top 0.254: U$6.1 29.3,36.28 C30.1
BOOT_MOTOR
  Top 0.254: U$4.1 29.56,71.57 C18.1
BOOT_MOTOR'
  Top 0.254: U$7.1 29.25,22.69 C36.1
EN1  (via drill 0.6)
  Top 0.406: PIC16F1718.21 23.15,49.8 24.36,48.59 v43.35,48.59 | U$3.5 35.31,81.63 v36.2,80.69
  Bottom 0.406: v36.2,80.69 43.86,73.08 43.86,49.1 v43.35,48.59
EN2  (via drill 0.6)
  Top 0.406: PIC16F1718.20 22.59,49.14 24.56,47.17 v40.53,47.17 | U$4.5 35.46,67.42 v36.28,66.6
  Bottom 0.406: v36.28,66.6 36.22,66.74 40.98,61.98 40.98,47.56 v40.53,47.17
EN3  (via drill 0.6)
  Top 0.406: PIC16F1718.19 21.94,48.5 24.8,45.64 v36.89,45.64 | U$2.5 35.37,54.32 v36.44,53.49
  Bottom 0.406: v36.44,53.49 37.18,53.04 38.3,52.53 38.3,47.05 v36.89,45.64
EN4  (via drill 0.6)
  Top 0.406: PIC16F1718.18 20.86,47.84 24.4,44.3 v36.89,44.3 | U$6.5 35.35,32.13 v35.94,31.54
  Bottom 0.406: v35.94,31.54 38.03,31.54 38.27,31.78 38.27,43.16 37.13,44.3 v36.89,44.3
EN5  (via drill 0.6)
  Top 0.406: PIC16F1718.15 14.47,45.88 17.47,42.88 36.14,42.88 36.17,42.89 v40.65,42.89 | U$7.5 35.16,18.54 v35.9,17.88
  Bottom 0.406: v35.9,17.88 39.42,17.88 41.36,19.82 41.36,42.2 v40.65,42.89
EN6  (via drill 0.6)
  Top 0.406: PIC16F1718.14 11.32,44.54 11.92,43.94 14.61,43.94 17.24,41.31 37.33,41.31 37.32,41.28 37.37,41.31 v43.57,41.31 | U$5.5 35.02,5.17 v35.9,4.43
  Bottom 0.406: v35.9,4.43 40.21,4.41 43.96,8.16 43.96,40.94 v43.57,41.31
GND  (via drill 0.33, 0.5, 0.6, 1)  (6 unrouted)
  Top 0.254: U$2.6 32.09,55.59 | U$3.6 32,82.9 | U$4.6 32.02,68.69 | 24.89,78.83 25.65,79.59 26.89,79.59 R10.1 | U$5.6 31.72,6.44 | U$6.6 31.77,33.4 | U$7.6 31.71,19.81 | 24.66,29.33 25.42,30.09 26.66,30.09 R19.1
  Top 0.406: C1.2 7.02,54.08 8.67,55.73 PROGRAMMING.3 | 7.93,38.15 9.33,38.15 | 10.83,38.15 9.33,38.15 | ADP7142.2 9.29,38.11 9.33,38.15 | PIC16F1718.5 8.68,47.18 9.35,47.85 10.65,46.55 PIC16F1718.16
  Top 1.016: U$2.9 32.09,55.59 32.09,52.1 31.78,51.78 | U$3.9 32,82.9 32,79.41 31.68,79.09 | U$4.9 32.02,68.69 32.02,65.2 31.71,64.88 | U$5.9 31.72,6.44 31.72,2.95 31.41,2.63 | U$6.9 31.77,33.4 31.77,29.9 31.45,29.59 | U$7.9 31.71,19.81 31.71,16.32 31.4,16
  other vias: 29.55,51.15 35.9,51.15 46.06,51.15 60.99,51.15 67.34,51.15 29.46,78.45 35.81,78.45 45.97,78.45 60.89,78.45 67.24,78.45 29.48,64.24 35.83,64.24 45.99,64.24 60.92,64.24 67.27,64.24 48.76,78.45 41.14,77.56 29.18,2 35.53,2 45.69,2 60.62,2 66.97,2 29.23,28.95 35.58,28.95 45.74,28.95 60.66,28.95 67.01,28.95 29.17,15.36 35.52,15.36 45.68,15.36 60.61,15.36 66.96,15.36 48.53,28.95 39.69,28.22 2.8,63.4 17.28,63.33 2.74,30.03 17.36,29.96 75.35,79.48 75.42,77.2 75.74,63.56 75.74,65.61 75.58,52.29 75.58,50.39 75.19,29.99 75.19,28.25 75.35,16.51 75.35,14.7 75.42,3.51 75.39,1.92 9.28,38.08 8.14,49.11 10.68,49.18 8.01,46.51 9.28,47.81 10.68,46.59 70.3,51.09 55.87,50.78 52.41,50.86 49.85,50.88 33.34,50.91 31.23,50.93 26.91,50.4 25.82,28.12 31.26,28.18 33.47,28.1 37.68,28.1 50.48,28.15 53.18,28.12 57.27,28.18 70.37,28 26.3,14.66 31.08,14.66 33.29,14.64 37.2,14.49 39.21,14.43 41.21,14.46 47.33,14.36 49.47,14.36 51.2,14.41 52.85,14.41 54.29,14.41 55.77,14.41 57.16,14.41 58.66,14.38 61.76,14.33 69.69,14.49 71.03,14.38 72.56,14.43 69.79,1.91 56.86,1.81 54.34,1.76 52.39,1.76 50.66,1.81 48.99,1.81 47.16,1.86 39.36,1.73 33.87,1.84 32.3,1.84 30.75,1.84 24.96,1.76 25.29,63.76 31.23,63.76 32.96,63.71 48.15,63.91 50.03,63.89 51.73,63.81 53.38,63.79 55.13,63.76 57.52,63.84 70.32,63.61 25.49,77.32 27.34,77.27 31.59,77.22 33.49,77.22 37.12,77.17 43.8,77.55 50.79,77.4 52.77,77.35 54.73,77.3 56.78,77.3 58.87,77.35 70.17,77.25 72.25,77.2
  pour Bottom: 1.93,29.15 18.13,29.15 18.2,64.19 2,64.19
  pour Bottom: 24.79,54.64 75.9,54.64 75.83,49.85 24.72,49.85
  pour Top (no thermals): 24.79,52.73 76.54,52.73 76.54,49.98 24.79,49.98
  pour Bottom: 24.7,81.94 75.98,81.87 75.84,76.45 24.49,76.59
  pour Top: 24.7,80.04 76.45,80.04 76.38,76.53 24.63,76.53
  pour Bottom: 24.72,67.74 75.99,67.74 76.06,63.15 24.79,63.15
  pour Top: 24.72,65.83 76.47,65.83 76.54,63.14 24.79,63.14
  pour Bottom: 24.42,5.49 75.78,5.42 75.68,0.86 24.56,0.63
  pour Top: 24.42,3.58 76.17,3.58 76.31,0.63 24.56,0.63
  pour Bottom: 24.47,32.44 75.51,32.28 75.45,27.35 24.41,27.51
  pour Top: 24.47,30.54 76.22,30.54 76.16,27.51 24.41,27.51
  pour Bottom: 24.41,18.86 75.45,18.86 75.52,14.13 24.48,14.13
  pour Top: 24.41,16.95 76.16,16.95 76.3,14.06 24.55,14.06
  pour Top: 17.69,0.46 17.72,0.43 24.93,0.43 25.25,0.75 25.25,41.15 25.27,41.17 25.27,89.99 24.73,90.53 16.4,90.53 -11.19,62.94 -11.19,48.71 -11.19,27.76 16.11,0.46 17.65,0.46
  pour Top: 74.7,80.35 74.7,90.55 83.99,90.55 84.31,90.55 84.31,0.35 75.17,0.35 75.17,0.51 74.62,0.51 74.62,40.86 74.54,40.86 73.75,41.65 46.1,41.65 44.44,43.31 42.7,43.31 41.68,44.33 38.53,44.33 38.53,45.84 38.6,45.91 41.37,45.91 42.47,47.01 44.28,47.01 45.15,47.88 45.15,48.04 45.93,48.82 45.93,49.05 47.12,50.24 74.54,50.24 74.93,50.63 74.93,80.07 74.72,80.28
MCLR
  Top 0.406: PROGRAMMING.1 3.81,58.11 C1.1 3.13,53.4 R4.2
  Bottom 0.406: R3.1 3.8,58.12 PROGRAMMING.1
MCLR'
  Top 0.406: PIC16F1718.26 8.7,51.37 8.22,51.85 R4.1
N$10
  Top 0.406: R1.1 10.95,33.31 PIN.A
N$11
  Top 0.406: R2.1 10.43,42.14 POUT.A
  Top 0.61: 10.86,42.6 POUT.A
N$28
  Top 0.254: R8.1 LED4.A
N$30
  Top 0.254: R11.1 LED1.A
N$31
  Top 0.254: R14.1 LED2.A
N$32'
  Top 0.254: R17.1 LED3.A
N$33'
  Top 0.254: R20.1 LED5.A
N$34'
  Top 0.254: R23.1 LED6.A
PGC
  Top 0.406: PIC16F1718.24 10.02,52.41 13.79,56.18 13.79,58.29 PROGRAMMING.5
PGD
  Top 0.406: PIC16F1718.25 9.36,54.43 11.23,56.3 PROGRAMMING.4
PH_5
  pour Top: 32.41,60.99 32.41,58.77 33.05,58.77 33.68,58.13 40.35,58.13 43.52,53.69 49.87,53.69 49.87,60.99
PH_5'
  pour Top: 32.04,11.84 32.04,9.62 32.68,9.62 33.31,8.98 39.98,8.98 43.15,4.54 49.5,4.54 49.5,11.84
PH_6
  pour Top: 32.32,88.29 32.32,86.07 32.95,86.07 33.59,85.44 40.25,85.44 43.43,80.99 49.78,80.99 49.78,88.29
PH_6'
  pour Top: 32.09,38.79 32.09,36.57 32.72,36.57 33.36,35.94 40.02,35.94 43.2,31.49 49.55,31.49 49.55,38.79
PH_MOTOR
  pour Top: 32.34,74.09 32.34,71.86 32.98,71.86 33.61,71.23 40.28,71.23 43.45,66.78 49.8,66.78 49.8,74.09
PH_MOTOR'
  pour Top: 32.03,25.21 32.03,22.98 32.67,22.98 33.3,22.35 39.97,22.35 43.14,17.9 49.49,17.9 49.49,25.21
VCC  (via drill 1)
  Top 0.254: U$2.7 36.54,56.86 v36.68,56.65 | U$3.7 36.44,84.17 v36.66,83.95 | U$4.7 36.47,69.96 v36.62,69.78 | U$5.7 36.17,7.71 v36.31,7.53 | U$6.7 36.21,34.67 v36.39,34.49 | U$7.7 36.16,21.08 v36.32,20.92
  Top 0.305: R5.1 1.52,40.5 1.52,28.7 4,26.22 v10.42,26.22
  Top 0.406: ADP7142.3 10.22,36.73 10.22,35.37 10.18,35.33 8.52,35.33 8.34,35.51 ADP7142.1 8.15,36.56 6.52,36.56 | CIN.1 6.51,36.57 6.52,36.56 | v10.42,26.22 6.53,30.11 R1.2 6.53,36.54 6.52,36.56
  pour Bottom: 24.79,55.91 37.81,55.91 37.81,59.08 24.79,59.08
  pour Top: 35.9,55.59 35.9,57.18 39.4,57.18 39.4,54.32 37.17,54.32
  pour Bottom: 24.7,83.21 37.71,83.21 37.71,86.39 24.7,86.39
  pour Top: 35.81,82.9 35.81,84.48 39.3,84.48 39.3,81.63 37.08,81.63
  pour Bottom: 24.72,69.01 37.74,69.01 37.74,72.18 24.72,72.18
  pour Top: 35.83,68.69 35.83,70.28 39.33,70.28 39.33,67.42 37.1,67.42
  pour Bottom: 24.42,6.76 37.44,6.76 37.44,9.93 24.42,9.93
  pour Top: 35.53,6.44 35.53,8.03 39.03,8.03 39.03,5.17 36.8,5.17
  pour Bottom: 24.47,33.71 37.48,33.71 37.48,36.89 24.47,36.89
  pour Top: 35.58,33.4 35.58,34.98 39.07,34.98 39.07,32.13 36.85,32.13
  pour Bottom: 24.41,20.13 37.43,20.13 37.43,23.3 24.41,23.3
  pour Top: 35.52,19.81 35.52,21.4 39.02,21.4 39.02,18.54 36.79,18.54
  pour Bottom: 2.47,14.92 -6.11,23.5 -6.11,26.53 -5.57,27.07 17.77,27.07 19.48,28.78 19.48,37.38 19.54,37.44 25.52,37.44 26.14,36.82 26.14,33.8 26.08,33.74 23.53,33.74 23.53,24.19 25.04,22.68 25.32,22.68 25.45,22.55 25.45,20.07 25.38,20.14 23.6,20.14 23.53,20.07 23.53,11.07 25.31,9.29 25.59,9.29 25.66,9.22 25.66,7.09 25.32,6.75 22.92,6.75 22.85,6.68 22.85,0.77 22.78,0.7 16.26,0.7 2.57,14.39 2.57,14.81 2.6,14.81
  pour Bottom: 3.15,76.66 16.74,90.25 25.52,90.25 26.07,89.7 26.07,84 25.32,83.25 23.32,83.25 23.26,83.19 23.26,72.88 24.22,71.92 25.18,71.92 25.45,71.65 25.45,69.03 25.18,68.76 23.67,68.76 23.53,68.62 23.53,60.04 24.84,58.73 25.59,58.73 25.73,58.59 25.73,56.19 25.46,55.92 23.87,55.92 23.74,55.79 23.74,48.57 23.74,36.89 23.2,36.35 19.34,36.35 19.34,65.87 19.06,66.15 1.09,66.15 1.02,66.22 1.02,74.94 2.74,76.66 3.14,76.66
VDD  (via drill 1)
  Top 0.406: ADP7142.5 ADP7142.4 10.39,39.5 11.57,39.5 12.39,38.69 | 12.21,38.9 12.2,38.89 12.39,38.7 12.39,38.69 | PIC16F1718.17 16.58,47.18 v17.35,46.41 | 12.39,38.69 COUT.1 12.41,38 12.41,40.47 11.98,40.9 7.63,40.9 7.01,41.53 7.01,42.58 | v5.03,44.08 5.03,43.56 6.01,42.58 7.01,42.58 | 7.01,42.58 R2.2
  Top 0.61: ADP7142.5
  Bottom 0.406: PROGRAMMING.2 6.14,54.77 R3.2 | C2.1 10.71,44.64 C3.1 15.55,44.61 v17.35,46.41 | 7.25,44.27 5.03,44.27 v5.03,44.08
  Bottom 0.61: C2.1 7.25,44.27 5.7,45.82 R3.2
VOUT_1  (via drill 0.76)
  Top 0.254: R9.2 28.35,89.56 52.32,89.56 55.65,86.23 L2.2 | C13.1 65.16,88.76 R11.2
  other vias: 70.48,87.98 70.48,84.67 70.48,86.33
  pour Top: 53.27,89.88 53.27,81.31 59.3,81.31 62.16,84.17 71.3,84.17 71.3,89.88
  pour Bottom: 83.97,76.39 84.11,89.26 73.65,89.25 60.7,89.25 60.7,82.64 77.08,82.64 76.94,76.39
VOUT_2  (via drill 0.76)
  Top 0.254: R12.2 27.87,75.36 51.84,75.36 55.67,72.03 L3.2 | C19.1 65.18,74.56 R14.2
  other vias: 70.5,70.97 70.5,72.63 70.5,69.32
  pour Top: 53.3,75.17 53.3,67.1 59.33,67.1 62.31,68.56 71.46,68.56 71.33,75.17
  pour Bottom: 84.1,63.74 84.17,75.36 60.41,75.36 60.34,68.56 77.11,68.56 77.11,63.74
VOUT_3  (via drill 0.76)
  Top 0.254: R6.2 27.01,61.81 27.39,62.2 53.43,62.2 53.94,61.69 53.94,61.18 55.72,59.4 55.72,56.89 L1.2 | R8.2 71.11,61.46 v70.45,61.31
  other vias: 70.45,59.66 70.45,58
  pour Top: 53.37,62.07 53.37,54 59.4,54 62.26,56.86 71.53,56.86 71.53,62.07
  pour Bottom: 83.91,45.68 84.22,62.47 78.07,62.47 76.67,62.45 64.22,62.45 64.22,55.34 77.18,55.34 77.11,45.92
VOUT_4  (via drill 0.76)
  Top 0.254: R18.2 28.12,40.06 52.09,40.06 55.42,36.73 L5.2 | C31.1 64.93,39.26 R20.2
  other vias: 70.25,38.48 70.25,35.18 70.25,36.83
  pour Top: 53.04,40.38 53.04,31.81 59.07,31.81 61.93,34.67 71.07,34.67 71.07,40.38
  pour Bottom: 84.03,27.43 84.02,44.28 73.34,44.44 73.42,39.75 60.47,39.75 60.47,33.14 76.85,33.14 76.71,27.43
VOUT_5  (via drill 0.76)
  Top 0.254: R21.2 27.56,26.48 51.53,26.48 55.36,23.15 L6.2 | C37.1 64.87,25.68 R23.2
  other vias: 70.19,22.09 70.19,23.75 70.19,20.44
  pour Top: 52.99,26.29 52.99,18.22 59.02,18.22 62,19.68 71.15,19.68 71.02,26.29
  pour Bottom: 84.06,14.86 83.98,25.79 59.95,25.79 60.03,19.68 76.8,19.68 76.8,14.86
VOUT_6  (via drill 0.76)
  Top 0.254: R15.2 26.64,12.66 27.02,13.04 53.06,13.04 53.57,12.54 53.57,12.03 55.35,10.25 55.35,7.74 L4.2 | R17.2 70.74,12.31 v70.08,12.16
  other vias: 70.08,10.51 70.08,8.85
  pour Top: 53,12.92 53,4.85 59.03,4.85 61.89,7.71 71.16,7.71 71.16,12.92
  pour Bottom: 84.17,0.74 84.3,13.28 77.7,13.26 76.3,13.3 63.86,13.3 63.86,6.19 76.81,6.19 76.68,0.72
VSNS1_MOTOR
  Top 0.254: R12.1 R13.2 27.73,67.42 U$4.4
VSNS1_MOTOR1'
  Top 0.254: R21.1 R22.2 27.42,18.54 U$7.4
VSNS_1'
  Top 0.254: R15.1 R16.2 27.43,5.17 U$5.4
VSNS_2'
  Top 0.254: R18.1 R19.2 27.48,32.13 U$6.4
VSNS_5
  Top 0.254: R6.1 R7.2 27.8,54.32 U$2.4
VSNS_6
  Top 0.254: R9.1 R10.2 27.7,81.63 U$3.4

### Text on the board
tPlace: C:/Users/Sean/Desktop/Spring 2016/ECE 552/IEEE.bmp | C:/Users/Sean/Desktop/Spring 2016/ECE 552/north-carolina-state-wolfpack-stencil.bmp
tNames: C:/Users/Sean/Desktop/Spring 2016/ECE 552/IEEE.bmp | C:/Users/Sean/Desktop/Spring 2016/ECE 552/north-carolina-state-wolfpack-stencil.bmp | C:/Users/Sean/Desktop/Spring 2016/ECE 552/north-carolina-state-wolfpack-stencil.bmp
bNames: Sean Micheal Ketring | Josh Stevens